# EAGLE design EEGAmp_SMT (EAGLE 9.6.2)
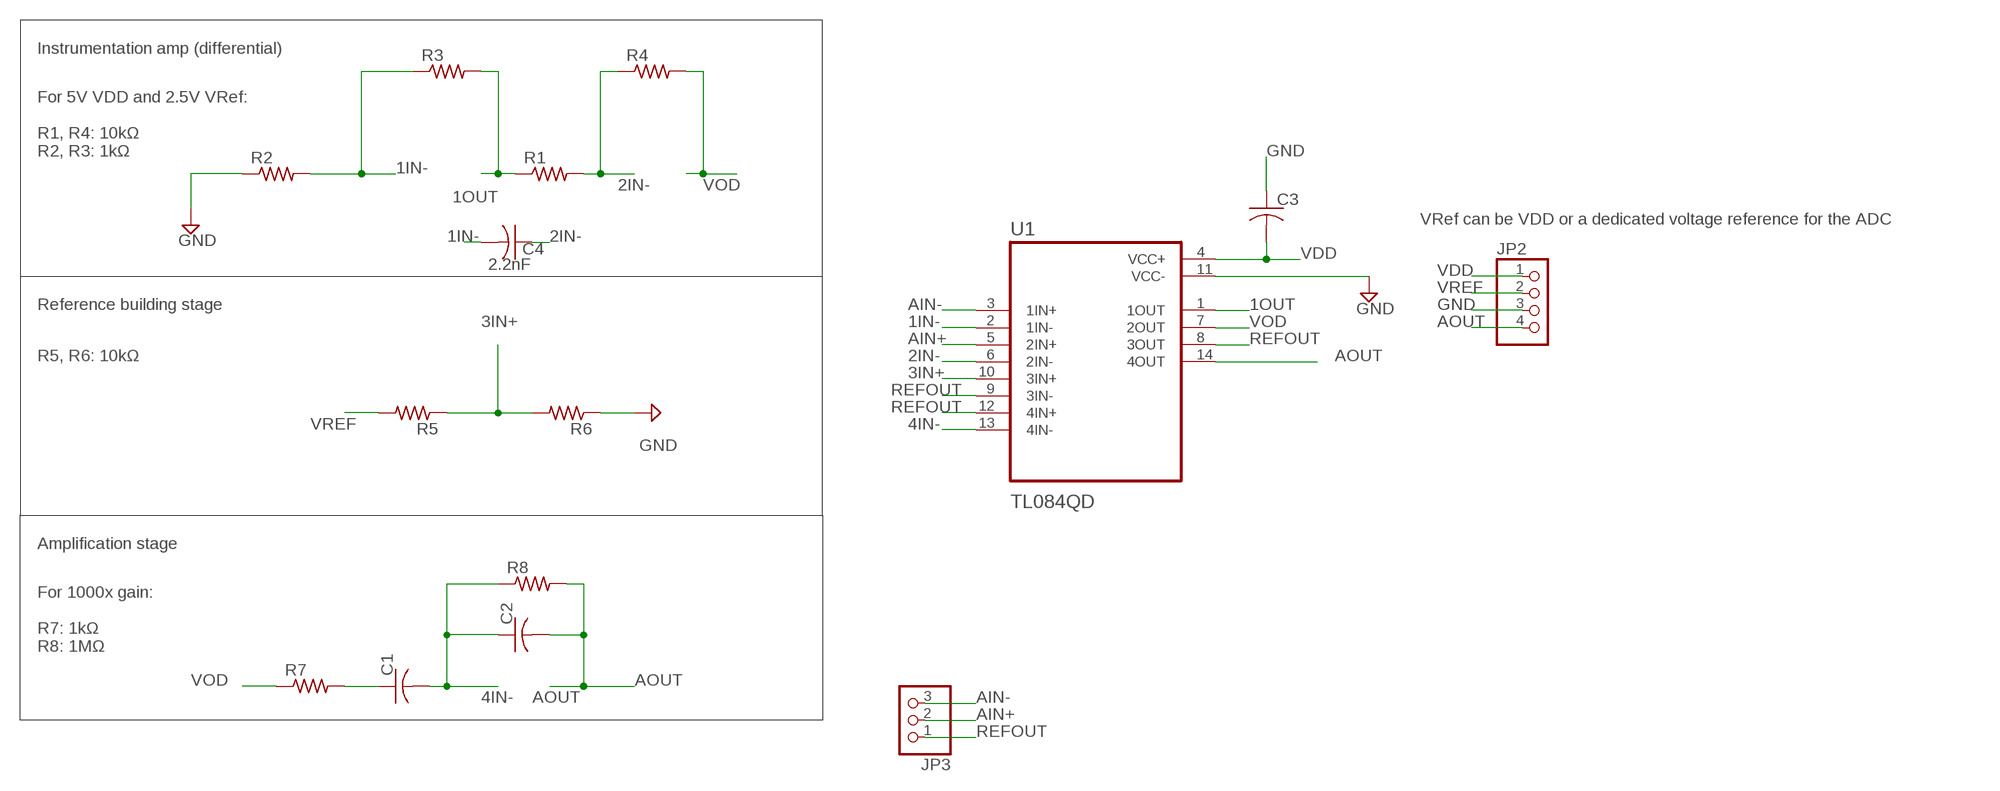
[diagram p0: schematic, sheet 1]

## Parts
C1  C-USC0402  [C0402]
C2  C-USC0402  [C0402]
C3  C-USC0402  [C0402]
C4  2.2nF  C-USC0402  [C0402]
JP2  PINHD-1X4  [1X04]
JP3  PINHD-1X3  [1X03]
R1  R-US_R0402  [R0402]
R2  R-US_R0402  [R0402]
R3  R-US_R0402  [R0402]
R4  R-US_R0402  [R0402]
R5  R-US_R0402  [R0402]
R6  R-US_R0402  [R0402]
R7  R-US_R0402  [R0402]
R8  R-US_R0402  [R0402]
U1  TL084QD  [SOIC127P600X175-14N]

## Nets
1IN-: C4.2 R2.2 R3.1 U1.2(1IN-)
1OUT: R1.1 R3.2 U1.1(1OUT)
2IN-: C4.1 R1.2 R4.1 U1.6(2IN-)
3IN+: R5.1 R6.2 U1.10(3IN+)
4IN-: C1.2 C2.1 R8.1 U1.13(4IN-)
AIN+: JP3.2 U1.5(2IN+)
AIN-: JP3.3 U1.3(1IN+)
AOUT: C2.2 JP2.4 R8.2 U1.14(4OUT)
GND: C3.1 JP2.3 R2.1 R6.1 U1.11(VCC-)
N$9: C1.1 R7.2
REFOUT: JP3.1 U1.8(3OUT) U1.9(3IN-) U1.12(4IN+)
VDD: C3.2 JP2.1 U1.4(VCC+)
VOD: R4.2 R7.1 U1.7(2OUT)
VREF: JP2.2 R5.2

## Notes on the sheet
- Instrumentation amp (differential)
- For 5V VDD and 2.5V VRef:
  
  R1, R4: 10kΩ
  R2, R3: 1kΩ
- VRef can be VDD or a dedicated voltage reference for the ADC
- Reference building stage
- R5, R6: 10kΩ
- Amplification stage
- For 1000x gain:
  
  R7: 1kΩ
  R8: 1MΩ

## Library data of the parts
C1-C4 = rcl:C-US: CAPACITOR, American symbol; SPICEPREFIX: C
JP2 = pinhead:PINHD-1X4: PIN HEADER
JP3 = pinhead:PINHD-1X3: PIN HEADER
R1-R8 = rcl:R-US_: RESISTOR, American symbol; SPICEPREFIX: R
U1 = TL084QD:TL084QD: Check availability <https://pricing.snapeda.com/parts/TL084QD/Texas%20Instruments/view-part?ref=eda>; AVAILABILITY: In Stock; CHECK_PRICES: https://www.snapeda.com/parts/TL084QD/Texas+Instruments/view-part/?ref=eda; DESCRIPTION: Quad, 30-V, 3-MHz, 13-V/µs slew rate, In to V+, JFET-input op amp; MF: Texas Instruments; MP: TL084QD; PACKAGE: SOIC-14 Texas Instruments; PRICE: None; PURCHASE-URL: https://www.snapeda.com/api/url_track_click_mouser/?unipart_id=1136083&manufacturer=Texas Instruments&part_name=TL084QD&search_term=tl084; SNAPEDA_LINK: https://www.snapeda.com/parts/TL084QD/Texas+Instruments/view-part/?ref=snap

## Board
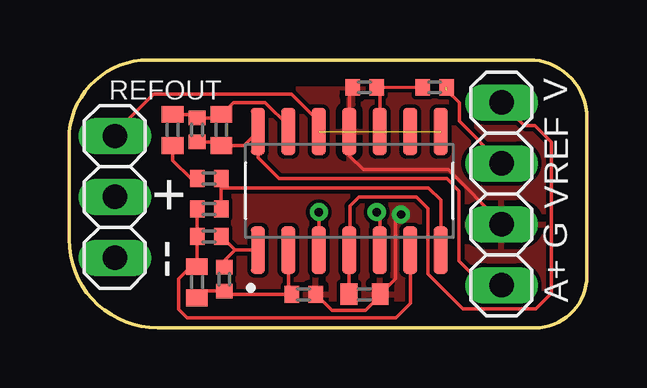
[diagram p1: board, top side]
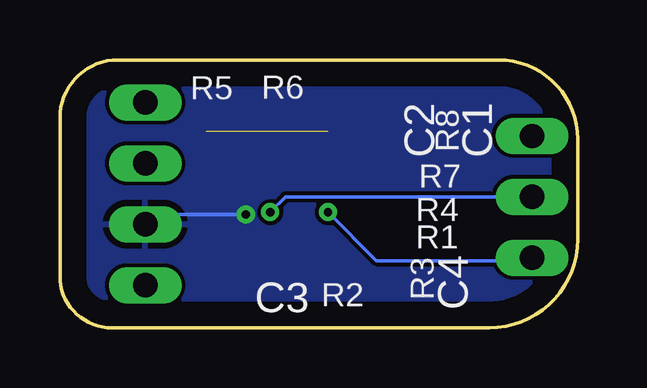
[diagram p2: board, bottom side, seen from below]

Size 21.59 x 11.18 mm. Coordinates in mm from the lower left corner, seen from the top.
Outline: 0,7.87 arc-90 3.3,11.18 19.18,11.18 arc-90 21.59,8.76 21.59,2.16 arc-90 19.43,0 3.68,0 arc-90 0,3.68 0,7.87
Copper layers (1*16): Top 0.035mm / dielectric 1.5mm / Bottom 0.035mm
Design rules "default": minimum track width 6mil, minimum drill 0.35mm, track to track 6mil, track to pad 6mil, pad to pad 6mil, via to via 6mil, smd to smd 6mil, copper to edge 40mil, drill to drill 6mil, minimum pad ring 10mil, minimum via ring 8mil, stop-mask expansion 4mil, vias tented up to drill 0mil, thermal gap 10mil

### Footprints (pad centres in the part's own frame; a part is rotated, then mirrored left to right if it is on the bottom)
C0402 = smd 0.7 x 0.9: 1 -0.65,0; 2 0.65,0
1X04 = drill 1.016 long: 1 -3.81,0; 2 -1.27,0; 3 1.27,0; 4 3.81,0
1X03 = drill 1.016 long: 1 -2.54,0; 2 0,0; 3 2.54,0
R0402 = smd 0.6 x 0.7: 1 -0.5,0; 2 0.5,0
SOIC127P600X175-14N = smd 1.97 x 0.6: 1 -2.475,3.81; 2 -2.475,2.54; 3 -2.475,1.27; 4 -2.475,0; 5 -2.475,-1.27; 6 -2.475,-2.54; 7 -2.475,-3.81; 8 2.475,-3.81; 9 2.475,-2.54; 10 2.475,-1.27; 11 2.475,0; 12 2.475,1.27; 13 2.475,2.54; 14 2.475,3.81

### Placement (x,y rotation side)
C1  4.32,8.26 90 top
C2  6.35,8.26 270 top
C3  12.32,1.4 180 top
C4  5.33,1.91 270 top
JP2  18.03,5.59 270 top
JP3  1.9,5.46 270 top
R1  5.84,3.81 180 top
R2  9.78,1.4 180 top
R3  6.48,2.03 90 top
R4  5.84,4.95 0 top
R5  15.24,10.03 0 top
R6  12.32,10.03 0 top
R7  5.84,6.22 180 top
R8  5.33,8.26 270 top
U1  11.68,5.71 90 top

### Tracks (layer width: path | path; a pad name or v marks a point on that pad's centre or on a via)
1IN-
  Top 0.152: U1.2 9.14,1.53 R2.2 6.61,1.4 R3.1 5.61,1.53 C4.2
1OUT
  Top 0.152: 6.48,2.73 R3.2 6.48,2.8 6.91,3.24 | R1.1 6.91,3.24 | 6.91,3.24 U1.1
2IN-
  Top 0.152: U1.6 14.22,1.02 13.62,0.41 4.92,0.41 4.57,0.76 4.57,2.05 5.08,2.55 C4.1 R1.2 R4.1
3IN+
  Top 0.152: R5.1 R6.2 12.95,9.9 U1.10
4IN-
  Top 0.152: U1.13 9.14,8.44 8.18,9.4 6.85,9.4 C2.1 6.2,8.76 R8.1 5.18,8.91 C1.2
AIN+  (via drill 0.35)
  Top 0.152: v12.83,4.83 12.95,4.7 U1.5
  Bottom 0.152: v12.83,4.83 12.19,5.46 JP3.2
AIN-  (via drill 0.35)
  Top 0.152: v10.41,4.83 U1.3
  Bottom 0.152: v10.41,4.83 8.38,2.79 2.03,2.79 JP3.3
AOUT
  Top 0.152: R8.2 6.2,7.76 C2.2 7.29,7.61 U1.14 7.87,7.11 8.76,6.22 15.75,6.22 16.26,5.71 16.26,2.79 17.27,1.78 JP2.4
GND  (via drill 0.35)
  Top 0.152: R2.1 10.97,0.72 12.37,0.72 12.97,1.32 C3.1 13.6,2.03 13.6,4.49 v13.84,4.73 | R6.1 11.69,9.91 U1.11 | U1.11 11.69,7.17 12.27,6.6 15.81,6.6 18.03,4.37 JP2.3 | U1.11
  Bottom 0.152: v13.84,4.73 17.62,4.73 JP2.3
  pour Bottom: 25.27,13.59 25.27,-2.41 -2.29,-2.41 -2.29,13.59
  pour Top: -2.54,13.21 25.02,13.21 25.02,-2.03 -2.54,-2.03
N$9
  Top 0.152: C1.1 4.33,7.6 4.33,6.99 5.09,6.22 R7.2
REFOUT  (2 unrouted)
  Top 0.152: JP3.1 1.86,8.05 1.86,8.08 3.54,9.75 9.27,9.75 10.41,8.61 U1.12
VDD
  Top 0.152: C3.2 11.67,3.23 U1.4 11.71,3.27 11.71,5.08 12.1,5.46 14.47,5.46 14.96,4.97 14.96,2.25 16.43,0.79 19.46,0.79 20.12,1.44 20.12,7.75 19.42,8.44 18.99,8.44 JP2.1
VOD
  Top 0.152: R7.1 R4.2 6.34,5.84 14.99,5.84 15.49,5.33 U1.7
VREF  (1 unrouted)
  Top 0.152: JP2.2 16.28,8.62 16.28,9.39 15.74,9.93

### Text on the board
tNames: REFOUT | V | VREF | + | G | -- | A+